# EasyEDA Pro project FOC12.epro, board PCB1
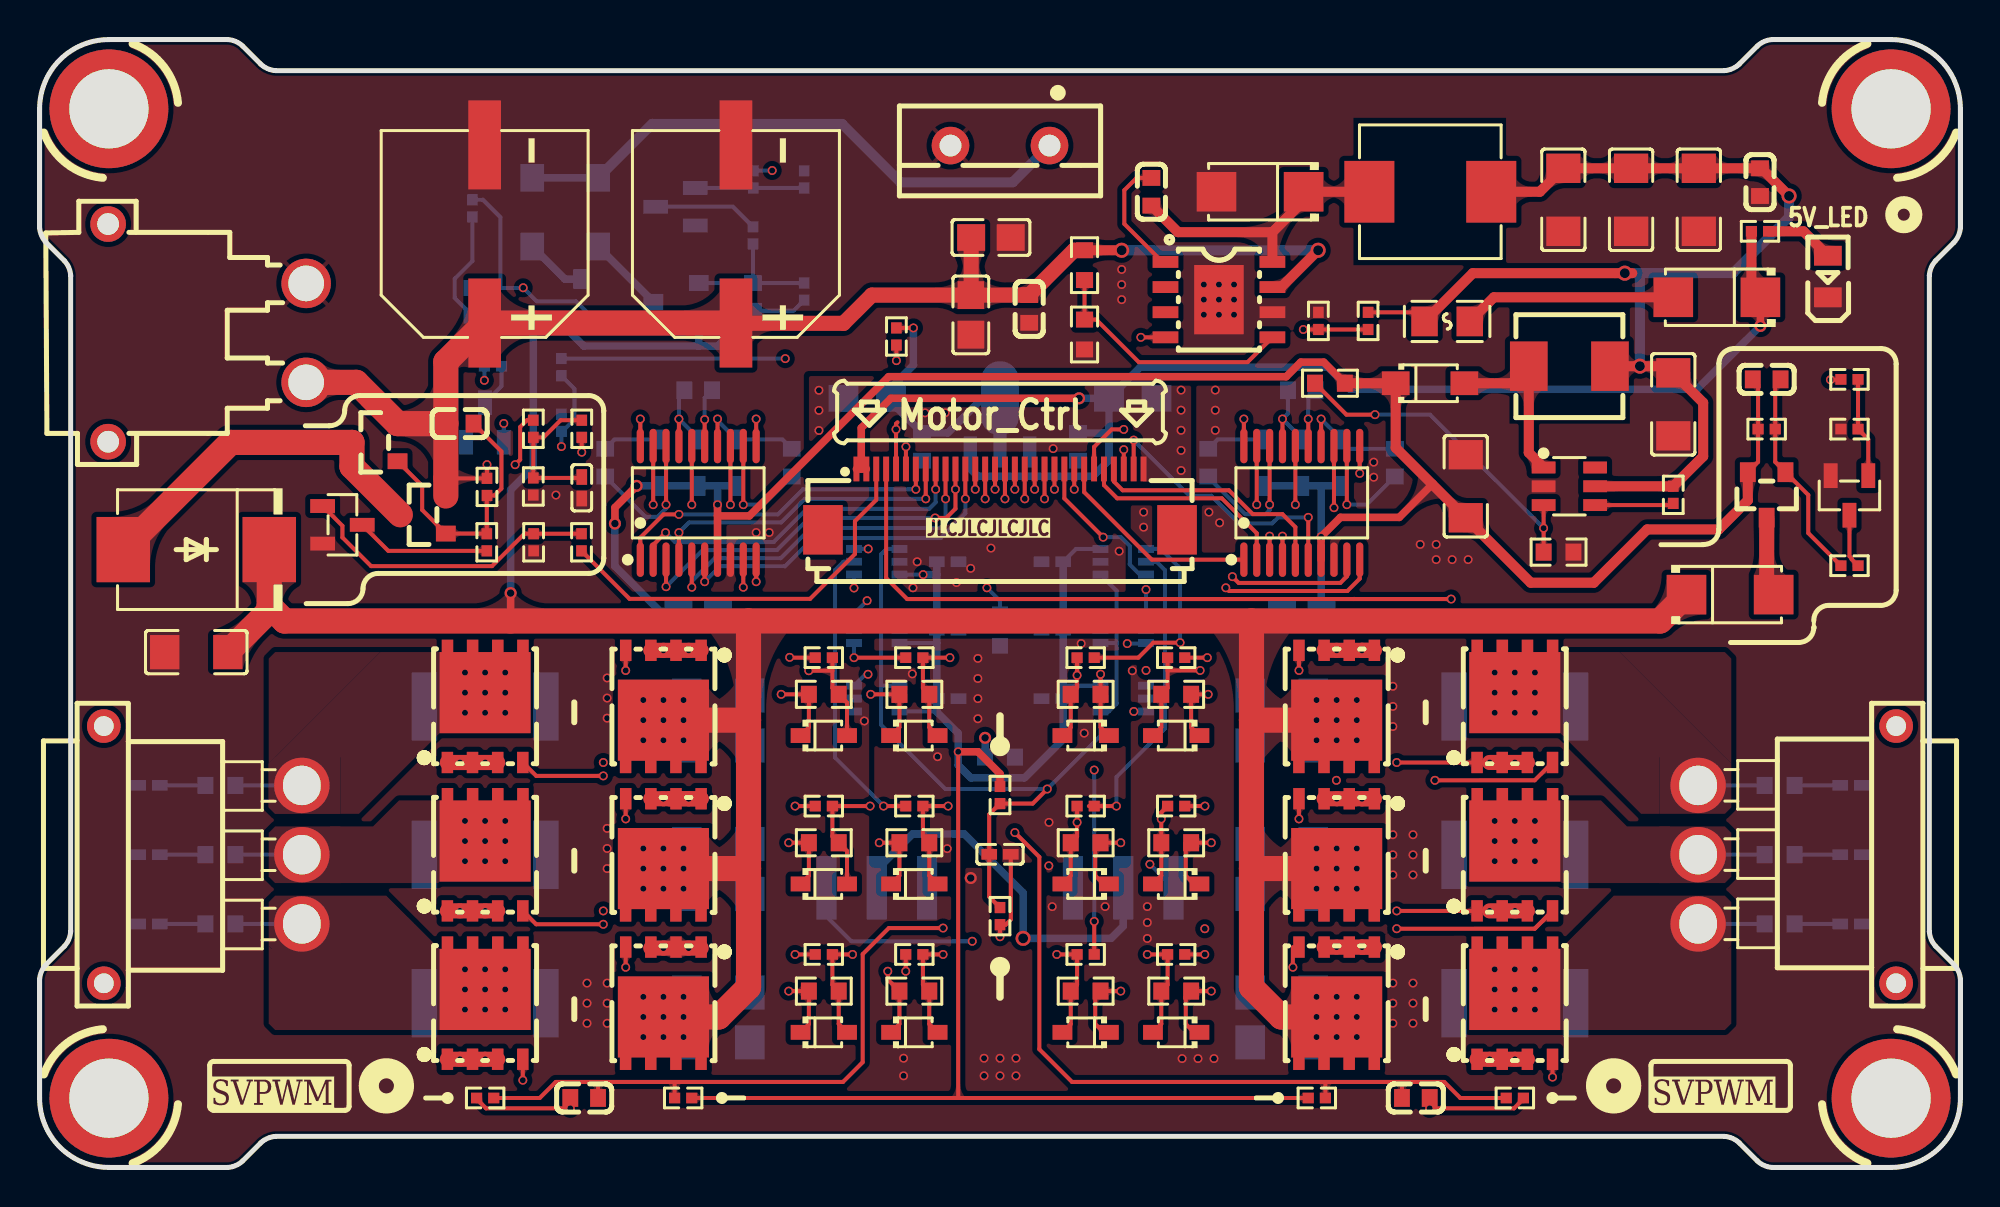
[diagram p8: board, top side]
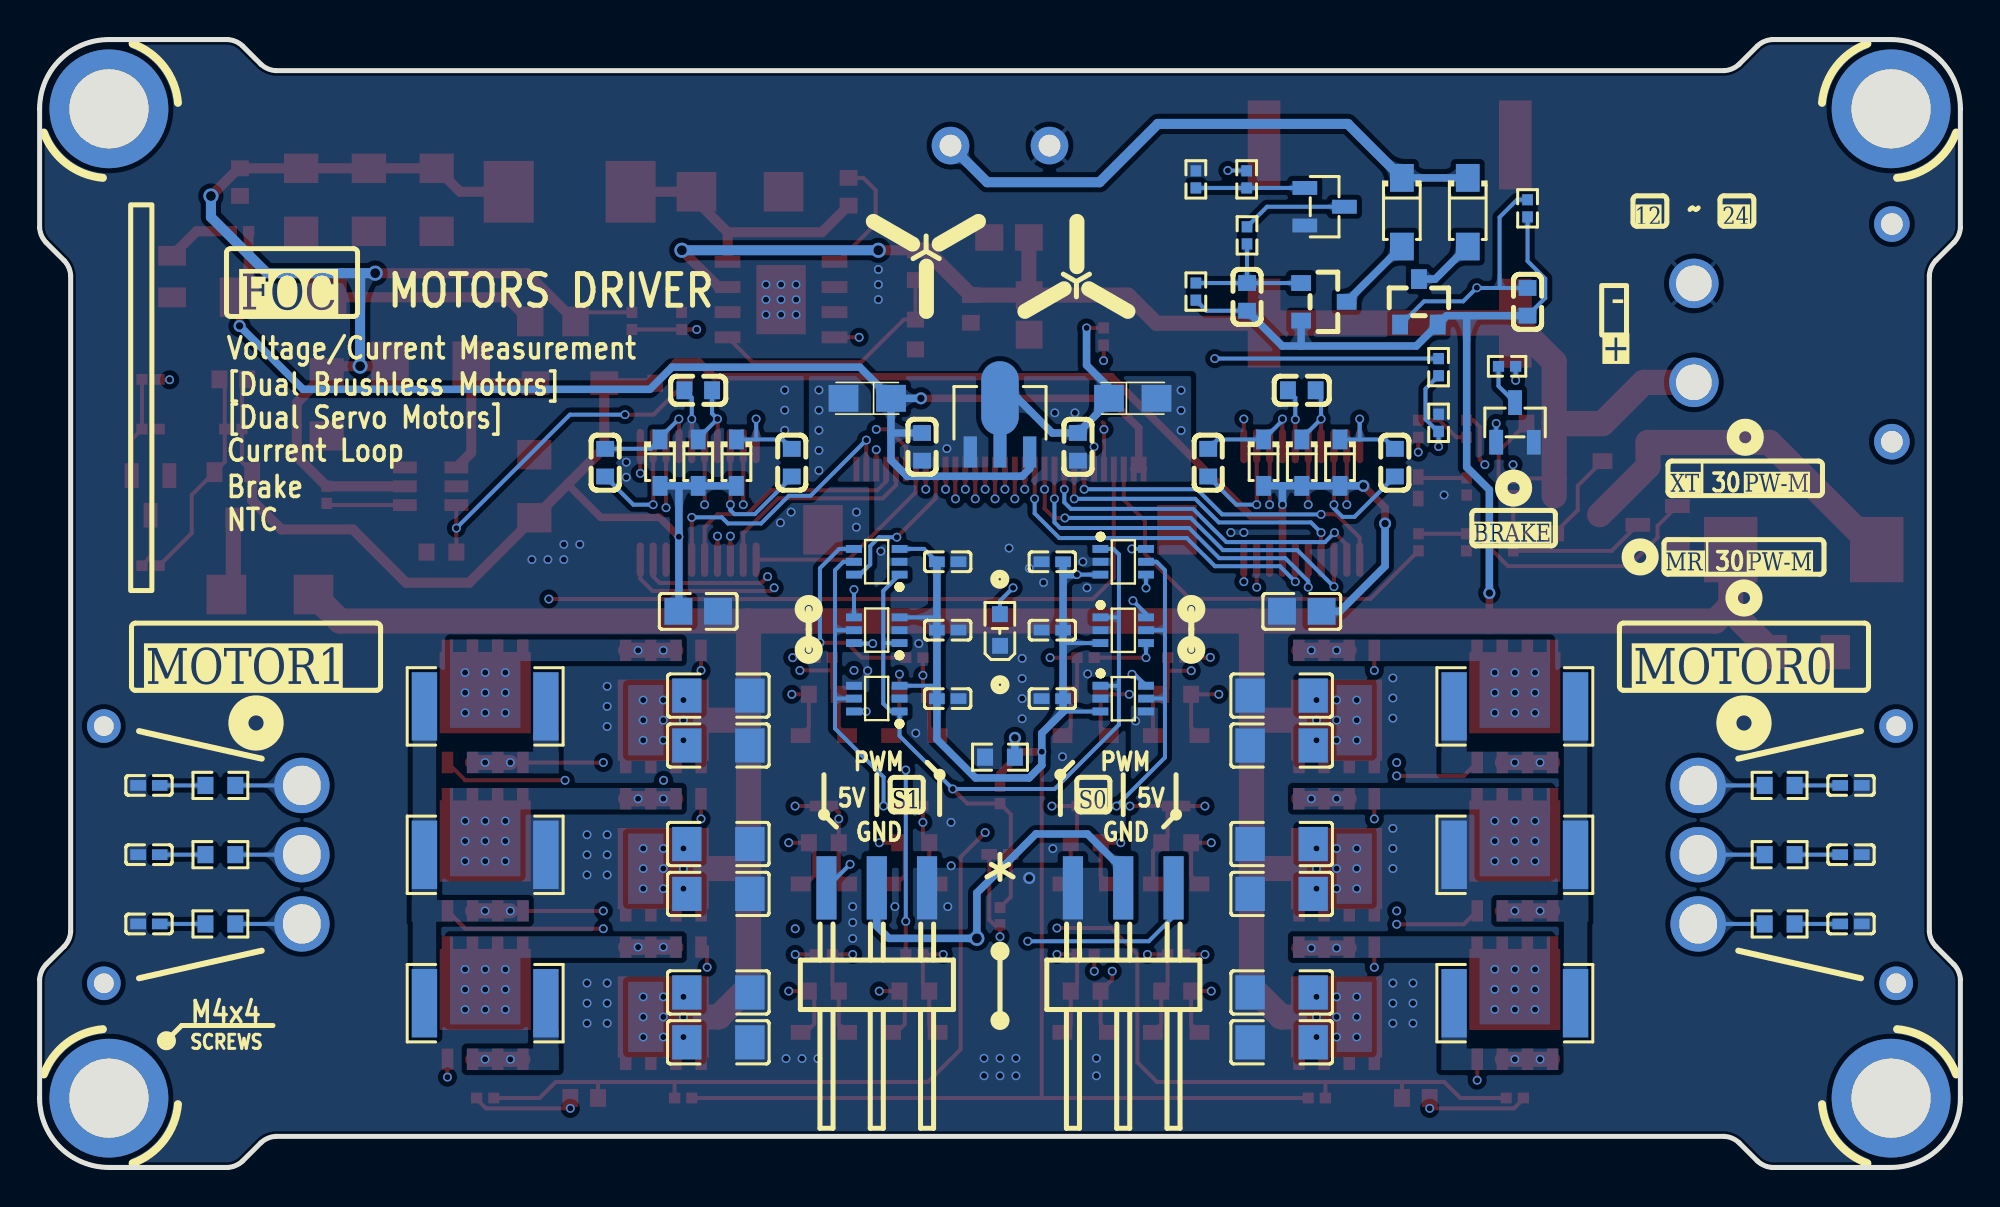
[diagram p9: board, bottom side, seen from below]

Outline 97 x 57 mm; copper layers: Top Layer, Inner1, Inner2, Bottom Layer. Coordinates in mm from the lower left corner of the outline.
Outline path: 0,53.5 0,47.5 arc(0.1,47.1) 0.33,46.75 1.24,45.83 arc(1.47,45.48) 1.57,45.08 1.57,11.92 arc(1.47,11.52) 1.24,11.17 0.33,10.25 arc(0.1,9.9) 0,9.5 0,3.5 arc(1.03,1.03) 3.5,0 9.5,0 arc(9.9,0.1) 10.25,0.32 11.17,1.24 arc(11.52,1.47) 11.92,1.57 85.08,1.57 arc(85.48,1.47) 85.83,1.24 86.75,0.32 arc(87.1,0.1) 87.5,0 93.5,0 arc(95.97,1.03) 97,3.5 97,9.5 arc(96.9,9.9) 96.68,10.25 95.76,11.17 arc(95.53,11.52) 95.43,11.92 95.43,45.08 arc(95.53,45.48) 95.76,45.83 96.68,46.75 arc(96.9,47.1) 97,47.5 97,53.5 arc(95.97,55.97) 93.5,57 87.5,57 arc(87.1,56.9) 86.75,56.67 85.83,55.76 arc(85.48,55.53) 85.08,55.43 11.92,55.43 arc(11.52,55.53) 11.17,55.76 10.25,56.67 arc(9.9,56.9) 9.5,57 3.5,57 arc(1.03,55.97) 0,53.5
Stack: Top Layer 0.035mm 外层铜厚1oz / Dielectric1 0.2104mm 7628 RC49% 8.6mil / Inner1 0.0152mm 内层铜厚 / Dielectric2 1.065mm 1.1mm H/HOZ Copper / Inner2 0.0152mm 内层铜厚 / Dielectric3 0.2104mm 7628 RC49% 8.6mil / Bottom Layer 0.035mm 外层铜厚1oz

## Design rules (mm)
template: 自定义配置
spacing copperThickness1oz (default): track to track 0.102, other pairs 0.152 to 0.3
spacing copperThickness2oz: track to track 0.203, other pairs 0.152 to 0.3
track width copperThickness1oz (default): min 0.127, default 0.254, max 2.54
track width copperThickness2oz: min 0.203, default 0.254, max 2.54
differential pair differentialPair (default): width min 0.127, default 0.254, max 2.54; gap min 0.152, default 0.152
via viaSize (default): diameter min 0.45, default 0.61, max 10; hole min 0.3, default 0.305, max 6.299

## Placement (name value [footprint] x y rotation side)
C1  100uF  [CAP-SMD_BD10.0-L10.3-W10.3-FD]  22.48 47.17 90 top
C2  100uF  [CAP-SMD_BD10.0-L10.3-W10.3-FD]  35.17 47.17 90 top
C3  10nF  [C0603]  56.15 49.31 270 top
C4  100nF  [C0603]  21.21 37.59 180 top
C5  47uF  [C1206]  82.5 38.56 90 top
C6  47uF  [C1206]  76.95 48.9 90 top
C7  47uF  [C1206]  80.37 48.9 90 top
C8  47uF  [C1206]  83.79 48.9 90 top
C9  100nF  [C0603]  86.88 49.79 270 top
C10  4.7uF  [C0805]  47.03 43.09 90 top
C11  4.7uF  [C0805]  48.04 47 180 top
C12  100nF  [C0603]  49.97 43.39 90 top
C13  47uF  [C1206]  72.02 34.42 270 top
C14  100nF  [C0603]  87.22 39.83 180 top
C15  2.2nF  [C0402]  27.38 34.35 90 top
C16  47uF  [C1206]  7.91 26.04 0 top
C17  22uF  [C1206]  34.28 8.84 180 bottom
C18  22uF  [C1206]  34.28 6.32 180 bottom
C19  22uF  [C1206]  34.28 16.34 180 bottom
C20  22uF  [C1206]  34.28 13.82 180 bottom
C21  22uF  [C1206]  34.28 21.32 180 bottom
C22  22uF  [C1206]  34.28 23.85 180 bottom
C23  100nF  [C0603]  37.98 35.62 270 bottom
C24  1nF  [C0402]  5.52 12.31 180 bottom
C25  1nF  [C0402]  5.52 15.81 180 bottom
C26  1nF  [C0402]  5.52 19.31 180 bottom
C27  100nF  [C0603]  33.26 39.28 0 bottom
C28  100nF  [C0603]  28.56 35.62 270 bottom
C31  10uF  [C0805]  33.26 28.1 180 bottom
C32  22uF  [C1206]  62.72 21.32 0 bottom
C33  22uF  [C1206]  62.72 23.85 0 bottom
C34  22uF  [C1206]  62.72 16.34 0 bottom
C35  22uF  [C1206]  62.72 13.82 0 bottom
C36  22uF  [C1206]  62.72 8.84 0 bottom
C37  22uF  [C1206]  62.72 6.32 0 bottom
C38  100nF  [C0603]  68.44 35.62 270 bottom
C39  1nF  [C0402]  91.48 19.31 0 bottom
C40  1nF  [C0402]  91.48 15.81 0 bottom
C41  1nF  [C0402]  91.48 12.31 0 bottom
C42  100nF  [C0603]  63.74 39.28 0 bottom
C43  100nF  [C0603]  59.02 35.62 270 bottom
C46  10uF  [C0805]  63.74 28.1 0 bottom
C47  100nF  [C0402]  45.86 23.69 180 bottom
C48  100nF  [C0402]  45.86 27.15 180 bottom
C49  100nF  [C0402]  45.86 30.61 180 bottom
C50  100nF  [C0603]  27.5 3.51 0 top
C51  100nF  [C0603]  69.5 3.51 180 top
C52  100nF  [C0402]  48.5 15.82 180 top
C53  100nF  [C0402]  51.14 23.69 0 bottom
C54  100nF  [C0402]  51.14 27.15 0 bottom
C55  100nF  [C0402]  51.14 30.61 0 bottom
C56  22uF  [CASE-A_3216]  55.21 38.87 0 bottom
C57  100nF  [C0603]  52.44 36.42 90 bottom
C58  22uF  [CASE-A_3216]  41.79 38.87 180 bottom
C59  100nF  [C0603]  44.56 36.42 90 bottom
C60  100nF  [C0603]  36.03 44 270 bottom
C61  100nF  [C0603]  21.86 43.75 270 bottom
CN1  XT30PW-M  [CONN-TH_XT30PW-M]  8.46 42.18 270 top
D1  SS34  [SMA_L4.3-W2.6-LS5.2-RD]  84.7 43.97 180 top
D2  DSK34  [SOD-123FL_L2.7-W1.8-LS3.8-RD]  70.22 39.63 0 top
D3  SS34  [SMA_L4.3-W2.6-LS5.2-RD]  85.37 28.95 0 top
D4  SS34  [SMA_L4.3-W2.6-LS5.2-RD]  61.63 49.31 180 top
D5  SK104C  [SMC_L6.9-W5.9-LS7.9-RD]  7.91 31.22 180 top
D6  1N5819WS  [SOD-323_L1.8-W1.3-LS2.5-RD]  35.19 35.62 270 bottom
D7  1N5819WS  [SOD-323_L1.8-W1.3-LS2.5-RD]  33.26 35.62 270 bottom
D8  1N5819WS  [SOD-323_L1.8-W1.3-LS2.5-RD]  31.33 35.62 270 bottom
D9  1N5819WS  [SOD-323_L1.8-W1.3-LS2.5-RD]  39.6 6.83 0 top
D10  1N5819WS  [SOD-323_L1.8-W1.3-LS2.5-RD]  39.6 14.33 0 top
D11  1N5819WS  [SOD-323_L1.8-W1.3-LS2.5-RD]  39.6 21.83 0 top
D12  1N5819WS  [SOD-323_L1.8-W1.3-LS2.5-RD]  44.17 6.83 0 top
D13  1N5819WS  [SOD-323_L1.8-W1.3-LS2.5-RD]  44.17 14.33 0 top
D14  1N5819WS  [SOD-323_L1.8-W1.3-LS2.5-RD]  44.17 21.83 0 top
D15  1N5819WS  [SOD-323_L1.8-W1.3-LS2.5-RD]  65.67 35.62 270 bottom
D16  1N5819WS  [SOD-323_L1.8-W1.3-LS2.5-RD]  63.74 35.62 270 bottom
D17  1N5819WS  [SOD-323_L1.8-W1.3-LS2.5-RD]  61.81 35.62 270 bottom
D18  1N5819WS  [SOD-323_L1.8-W1.3-LS2.5-RD]  57.4 21.83 180 top
D19  1N5819WS  [SOD-323_L1.8-W1.3-LS2.5-RD]  57.4 14.33 180 top
D20  1N5819WS  [SOD-323_L1.8-W1.3-LS2.5-RD]  57.4 6.83 180 top
D21  1N5819WS  [SOD-323_L1.8-W1.3-LS2.5-RD]  52.83 21.83 180 top
D22  1N5819WS  [SOD-323_L1.8-W1.3-LS2.5-RD]  52.83 14.33 180 top
D23  1N5819WS  [SOD-323_L1.8-W1.3-LS2.5-RD]  52.83 6.83 180 top
D24  DSK34  [SOD-123FL_L2.7-W1.8-LS3.8-RD]  28.21 48.28 270 bottom
D25  DSK34  [SOD-123FL_L2.7-W1.8-LS3.8-RD]  24.88 48.28 270 bottom
F1  SMD0805-100  [F0805]  71.08 42.76 0 top
FPC1  FPC-05F-30PH20  [FPC-SMD_30P-P0.50_XUNPU_FPC-05F-30PH20]  48.5 33.76 0 top
L1  22uH  [IND-SMD_L7.3-W6.6_MHCI06030]  70.23 49.31 0 top
L2  10uH  [IND-SMD_L5.4-W5.2_FXL0530]  77.25 40.49 180 top
LED1  KT-0805Y_黄  [LED0805-R-RD]  90.31 45.02 90 top
LED2  NCD0603G1_绿  [LED0603-RD_1]  48.5 27.16 90 bottom
NOREF  -  [Pad_e19069]  3.5 53.5 180 top
NOREF#2  -  [Pad_e19066]  93.5 3.5 180 top
NOREF#3  -  [Pad_e19067]  3.5 3.5 180 top
NOREF#4  -  [Pad_e19068]  93.5 53.5 180 top
Q1  WST4041  [SOT-23_L2.9-W1.3-P1.90-LS2.4-BR]  87.22 33.99 90 top
Q2  WST4041  [SOT-23_L2.9-W1.3-P1.90-LS2.4-BR]  16.92 36.64 0 top
Q3  WST4041  [SOT-23_L2.9-W1.3-P1.90-LS2.4-BR]  19.36 32.98 0 top
Q4  S8050  [SOT-23-3_L2.9-W1.3-P1.90-LS2.4-BR]  91.4 33.96 90 top
Q5  S8050  [SOT-23-3_L2.9-W1.3-P1.90-LS2.4-BR]  15.29 32.48 180 top
Q6  KNY3406C  [PDFN-8_L4.9-W5.8-P1.27-LS6.1-BL]  31.5 8.3 180 top
Q7  KNY3406C  [PDFN-8_L4.9-W5.8-P1.27-LS6.1-BL]  31.5 15.8 180 top
Q8  KNY3406C  [PDFN-8_L4.9-W5.8-P1.27-LS6.1-BL]  31.5 23.3 180 top
Q9  KNY3406C  [PDFN-8_L4.9-W5.8-P1.27-LS6.1-BL]  22.5 8.3 0 top
Q10  KNY3406C  [PDFN-8_L4.9-W5.8-P1.27-LS6.1-BL]  22.5 15.8 0 top
Q11  KNY3406C  [PDFN-8_L4.9-W5.8-P1.27-LS6.1-BL]  22.5 23.3 0 top
Q12  KNY3406C  [PDFN-8_L4.9-W5.8-P1.27-LS6.1-BL]  65.5 23.3 180 top
Q13  KNY3406C  [PDFN-8_L4.9-W5.8-P1.27-LS6.1-BL]  65.5 15.8 180 top
Q14  KNY3406C  [PDFN-8_L4.9-W5.8-P1.27-LS6.1-BL]  65.5 8.3 180 top
Q15  KNY3406C  [PDFN-8_L4.9-W5.8-P1.27-LS6.1-BL]  74.5 23.3 0 top
Q16  KNY3406C  [PDFN-8_L4.9-W5.8-P1.27-LS6.1-BL]  74.5 15.8 0 top
Q17  KNY3406C  [PDFN-8_L4.9-W5.8-P1.27-LS6.1-BL]  74.5 8.3 0 top
Q18  AMS1117-3.3V  [SOT-89-3_L4.5-W2.5-P1.50-LS4.2-BR]  48.5 37.51 270 bottom
Q19  WST4041  [SOT-23_L2.9-W1.3-P1.90-LS2.4-BR]  32.14 43.75 0 bottom
Q20  WST4041  [SOT-23_L2.9-W1.3-P1.90-LS2.4-BR]  27.34 43.75 270 bottom
Q21  S8050  [SOT-23-3_L2.9-W1.3-P1.90-LS2.4-BR]  32.11 48.55 0 bottom
Q22  S8050  [SOT-23-3_L2.9-W1.3-P1.90-LS2.4-BR]  22.49 37.65 270 bottom
R1  10kΩ  [R0402]  22.59 34.39 90 top
R2  330kΩ  [R0603]  52.77 45.6 90 top
R3  11.5kΩ  [R0402]  67.09 42.78 90 top
R4  0603WAF6802T5E  [R0603]  65.16 39.63 0 top
R5  100kΩ  [R0402]  24.93 37.33 90 top
R6  10kΩ  [R0402]  87.22 37.31 180 top
R7  10kΩ  [R0402]  91.4 30.41 180 top
R8  10kΩ  [R0402]  22.58 31.59 90 top
R9  0603WAF6802T5E  [R0603]  52.77 42.09 90 top
R10  3.3kΩ  [R0402]  64.58 42.78 270 top
R11  10kΩ  [R0402]  82.5 33.99 90 top
R12  3.4kΩ  [R0603]  76.71 31.1 180 top
R13  1kΩ  [R0402]  27.38 37.33 90 top
R14  10kΩ  [R0402]  24.93 34.41 270 top
R15  0Ω  [R0603]  48.5 20.73 180 bottom
R16  10kΩ  [R0402]  91.4 39.83 180 top
R17  10kΩ  [R0402]  27.37 31.59 270 top
R18  10kΩ  [R0402]  91.4 37.31 180 top
R19  10kΩ  [R0402]  24.95 31.59 270 top
R20  0603WAF100JT5E  [R0603]  39.6 8.91 0 top
R21  0603WAF100JT5E  [R0603]  39.6 16.41 0 top
R22  0603WAF100JT5E  [R0603]  39.6 23.91 0 top
R23  20kΩ  [R0402]  39.6 10.76 0 top
R24  0603WAF100JT5E  [R0603]  9.13 12.31 0 bottom
R25  20kΩ  [R0402]  39.6 18.26 0 top
R26  0603WAF100JT5E  [R0603]  9.13 15.81 0 bottom
R27  20kΩ  [R0402]  39.6 25.76 0 top
R28  0603WAF100JT5E  [R0603]  9.13 19.31 0 bottom
R30  0603WAF100JT5E  [R0603]  44.17 8.91 0 top
R31  0603WAF100JT5E  [R0603]  44.17 16.41 0 top
R33  0603WAF100JT5E  [R0603]  44.17 23.91 0 top
R34  10mΩ  [R2512]  22.5 8.3 0 bottom
R35  20kΩ  [R0402]  44.17 10.76 0 top
R36  20kΩ  [R0402]  44.17 18.26 0 top
R37  10mΩ  [R2512]  22.5 23.3 0 bottom
R38  20kΩ  [R0402]  44.17 25.76 0 top
R41  10mΩ  [R2512]  22.5 15.8 180 bottom
R42  0603WAF100JT5E  [R0603]  57.4 23.91 180 top
R43  0603WAF100JT5E  [R0603]  57.4 16.41 180 top
R44  0603WAF100JT5E  [R0603]  57.4 8.91 180 top
R45  20kΩ  [R0402]  57.4 25.76 180 top
R46  0603WAF100JT5E  [R0603]  87.87 19.31 180 bottom
R47  20kΩ  [R0402]  57.4 18.26 180 top
R48  0603WAF100JT5E  [R0603]  87.87 15.81 180 bottom
R49  20kΩ  [R0402]  57.4 10.76 180 top
R50  0603WAF100JT5E  [R0603]  87.87 12.31 180 bottom
R52  0603WAF100JT5E  [R0603]  52.83 23.91 180 top
R53  0603WAF100JT5E  [R0603]  52.83 16.41 180 top
R55  0603WAF100JT5E  [R0603]  52.83 8.91 180 top
R56  10mΩ  [R2512]  74.5 23.3 180 bottom
R57  20kΩ  [R0402]  52.83 25.76 180 top
R58  20kΩ  [R0402]  52.83 18.26 180 top
R59  10mΩ  [R2512]  74.5 8.3 180 bottom
R60  20kΩ  [R0402]  52.83 10.76 180 top
R63  10mΩ  [R2512]  74.5 15.8 0 bottom
R64  NCP15XH103F03RC  [R0402]  32.5 3.51 0 top
R65  NCP15XH103F03RC  [R0402]  64.5 3.51 180 top
R66  10kΩ  [R0402]  48.5 18.82 270 top
R67  10kΩ  [R0402]  48.5 12.7 270 top
R68  3kΩ  [R0402]  22.5 3.51 0 top
R69  3kΩ  [R0402]  74.5 3.51 180 top
R70  4.7kΩ  [R0402]  86.88 47.31 180 top
R71  3kΩ  [R0402]  43.27 41.99 90 top
R72  10kΩ  [R0402]  38.61 44.26 270 bottom
R73  10kΩ  [R0402]  21.86 48.47 270 bottom
R74  10kΩ  [R0402]  36.03 47.1 270 bottom
R75  10kΩ  [R0402]  22.89 40.49 180 bottom
R76  10kΩ  [R0402]  36.04 49.93 90 bottom
R77  10kΩ  [R0402]  38.61 49.93 90 bottom
R78  10kΩ  [R0402]  26.35 40.44 90 bottom
R79  10kΩ  [R0402]  26.35 37.63 90 bottom
U1  TPS5430DDAR  [ESOP-8_L4.9-W3.9-P1.27-LS6.0-TL-EP]  59.56 43.86 0 top
U2  MT3608L  [SOT-23-6_L2.9-W1.6-P0.95-LS2.8-BL_3]  77.25 34.42 270 top
U3  FD6288T  [TSSOP-20_L6.5-W4.4-P0.65-LS6.4-BL]  33.26 33.59 0 top
U4  FD6288T  [TSSOP-20_L6.5-W4.4-P0.65-LS6.4-BL]  63.74 33.59 0 top
U5  TP181A1-CR  [SC70-6_L2.1-W1.3-P0.65-LS2.3-BL]  42.28 30.61 270 bottom
U6  TP181A1-CR  [SC70-6_L2.1-W1.3-P0.65-LS2.3-BL]  54.72 30.61 90 bottom
U7  TP181A1-CR  [SC70-6_L2.1-W1.3-P0.65-LS2.3-BL]  42.28 23.69 270 bottom
U8  TP181A1-CR  [SC70-6_L2.1-W1.3-P0.65-LS2.3-BL]  42.28 27.15 270 bottom
U9  TP181A1-CR  [SC70-6_L2.1-W1.3-P0.65-LS2.3-BL]  54.72 27.15 90 bottom
U10  TP181A1-CR  [SC70-6_L2.1-W1.3-P0.65-LS2.3-BL]  54.72 23.69 90 bottom
U11  KH-2.54PH-1X3P-L13.5-WT  [HDR-SMD_3P-P2.54-H-M_KH-2.54PH-1X3P-L13.5-WT]  42.28 14.13 180 bottom
U12  KH-2.54PH-1X3P-L13.5-WT  [HDR-SMD_3P-P2.54-H-M_KH-2.54PH-1X3P-L13.5-WT]  54.72 14.13 180 bottom
U13  MR30PW-M30.G.Y  [CONN-TH_MR30PW-M30-G-Y]  8.24 15.81 270 top
U14  MR30PW-M30.G.Y  [CONN-TH_MR30PW-M30-G-Y]  88.76 15.81 90 top
U15  10Ω  [TO-220-2_L10.1-W4.5-P5.08-L]  48.5 51.64 180 top

## Footprints (pads in the part's own frame, mm; a bottom-side part is the same pattern mirrored in y, then rotated)
C0402
  rect 0.79x0.54 smd: 1(-0.545,0) 2(0.545,0)
C0603
  rect 0.8x0.9 smd: 1(-0.7,0) 2(0.7,0)
C0805
  rect 1.41x1.35 smd: 1(-1,0) 2(1,0)
C1206
  rect 1.485x1.728 smd: 1(-1.593,0) 2(1.593,0)
CAP-SMD_BD10.0-L10.3-W10.3-FD
  rect 4.5x1.65 smd: 1(-4.5,0) 2(4.5,0)
CASE-A_3216
  rect 1.5x1.359 smd: 1(-1.2,0) 2(1.2,0)
CONN-TH_MR30PW-M30-G-Y
  round 2.8 hole 1.995x1.9: 1(-3.5,5) 2(0,5) 3(3.5,5)
  round 1.7 hole 1: 4(6.5,-5) 5(-6.5,-5)
CONN-TH_XT30PW-M
  round 2.5 hole 1.8: 1(-2.5,5) 2(2.5,5)
  round 1.8 hole 1.1: 3(5.5,-5) 4(-5.5,-5)
ESOP-8_L4.9-W3.9-P1.27-LS6.0-TL-EP
  rect 1.3x0.6 smd: 1(-2.7,1.905) 2(-2.7,0.635) 3(-2.7,-0.635) 4(-2.7,-1.905) 5(2.7,-1.905) 6(2.7,-0.635) 7(2.7,0.635) 8(2.7,1.905)
  rect 2.5x3.5 smd: 9(0,0)
F0805
  rect 1.335x1.5 smd: 1(-1.143,0) 2(1.143,0)
FPC-SMD_30P-P0.50_XUNPU_FPC-05F-30PH20
  rect 0.3x1.25 smd: 1(-7.25,1.538) 2(-6.75,1.538) 3(-6.25,1.538) 4(-5.75,1.538) 5(-5.25,1.538) 6(-4.75,1.538) 7(-4.25,1.538) 8(-3.75,1.538) 9(-3.25,1.538) 10(-2.75,1.538) 11(-2.25,1.538) 12(-1.75,1.538) 13(-1.25,1.538) 14(-0.75,1.538) 15(-0.25,1.538) 16(0.25,1.538) 17(0.75,1.538) 18(1.25,1.538) 19(1.75,1.538) 20(2.25,1.538) 21(2.75,1.538) 22(3.25,1.538) 23(3.75,1.538) 24(4.25,1.538) 25(4.75,1.538) 26(5.25,1.538) 27(5.75,1.538) 28(6.25,1.538) 29(6.75,1.538) 30(7.25,1.538)
  rect 2x2.5 smd: 31(8.94,-1.538) 32(-8.94,-1.538)
HDR-SMD_3P-P2.54-H-M_KH-2.54PH-1X3P-L13.5-WT
  rect 1.02x3.2 smd: 1(-2.54,0) 2(0,0) 3(2.54,0)
IND-SMD_L5.4-W5.2_FXL0530
  rect 1.9x2.5 smd: 1(-2.05,0) 2(2.05,0)
IND-SMD_L7.3-W6.6_MHCI06030
  rect 2.525x3.119 smd: 1(-3.079,0) 2(3.079,0)
LED0603-RD_1
  rect 0.8x0.8 smd: 1(-0.799,-0.004) 2(0.799,0.004)
LED0805-R-RD
  rect 1x1.399 smd: 1(1.05,0) 2(-1.05,0)
Pad_e19066
  round 6 hole 4: 1(0,0)
Pad_e19067
  round 6 hole 4: 1(0,0)
Pad_e19068
  round 6 hole 4: 1(0,0)
Pad_e19069
  round 6 hole 4: 1(0,0)
PDFN-8_L4.9-W5.8-P1.27-LS6.1-BL
  rect 0.58x1.079 smd: 1(-1.907,-2.834) 2(-0.637,-2.834) 3(0.632,-2.834) 4(1.903,-2.834)
  rect 0.58x1.08 smd: 5(1.907,2.834) 6(0.637,2.834) 7(-0.632,2.834) 8(-1.903,2.834)
  rect 4.6x4.1 smd: 9(-0.003,0.695)
R0402
  rect 0.566x0.54 smd: 1(-0.433,0) 2(0.433,0)
R0603
  rect 0.806x0.864 smd: 1(-0.753,0) 2(0.753,0)
R2512
  rect 1.282x3.456 smd: 1(-3.067,0) 2(3.067,0)
SC70-6_L2.1-W1.3-P0.65-LS2.3-BL
  rect 0.399x0.8 smd: 1(-0.65,-1.151) 2(0,-1.151) 3(0.65,-1.151) 4(0.65,1.151) 5(0,1.151) 6(-0.65,1.151)
SMA_L4.3-W2.6-LS5.2-RD
  rect 2x2 smd: 1(-2.2,0) 2(2.2,0)
SMC_L6.9-W5.9-LS7.9-RD
  rect 2.7x3.3 smd: 1(-3.687,0) 2(3.687,0)
SOD-123FL_L2.7-W1.8-LS3.8-RD
  rect 1.4x1.2 smd: 1(-1.735,0) 2(1.735,0)
SOD-323_L1.8-W1.3-LS2.5-RD
  rect 1x0.75 smd: 1(-1.173,0) 2(1.173,0)
SOT-23-3_L2.9-W1.3-P1.90-LS2.4-BR
  rect 1.25x0.7 smd: 1(1,-0.95) 2(1,0.95) 3(-1,0)
SOT-23-6_L2.9-W1.6-P0.95-LS2.8-BL_3
  rect 0.6x1.2 smd: 1(-0.95,-1.3) 2(0,-1.3) 3(0.95,-1.3) 4(0.95,1.3) 5(0,1.3) 6(-0.95,1.3)
SOT-23_L2.9-W1.3-P1.90-LS2.4-BR
  rect 1x0.8 smd: 1(1.15,-0.95) 2(1.15,0.95) 3(-1.15,0)
SOT-89-3_L4.5-W2.5-P1.50-LS4.2-BR
  rect 1.575x0.672 smd: 1(1.356,-1.5) 3(1.356,1.5)
  custom 5.377x1.9 smd: 2(-1.356,0)
TO-220-2_L10.1-W4.5-P5.08-L
  round 1.9 hole 1.1: 1(-2.5,0) 2(2.5,0)
TSSOP-20_L6.5-W4.4-P0.65-LS6.4-BL
  oval 0.364x1.742 smd: 1(-2.925,-2.871) 2(-2.275,-2.871) 3(-1.625,-2.871) 4(-0.975,-2.871) 5(-0.325,-2.871) 6(0.325,-2.871) 7(0.975,-2.871) 8(1.625,-2.871) 9(2.275,-2.871) 10(2.925,-2.871) 11(2.925,2.871) 12(2.275,2.871) 13(1.625,2.871) 14(0.975,2.871) 15(0.325,2.871) 16(-0.325,2.871) 17(-0.975,2.871) 18(-1.625,2.871) 19(-2.275,2.871) 20(-2.925,2.871)

## Nets
As in the schematic.

Pads without a net: CN1 3 4; FPC1 31 32; NOREF 1; NOREF#2 1; NOREF#3 1; NOREF#4 1; U1 2 3; U2 6; U13 4 5; U14 4 5

## Via types
v1: diameter 0.45, hole 0.305, Top Layer to Bottom Layer, 383 vias
v2: diameter 0.61, hole 0.381, Top Layer to Bottom Layer, 7 vias
v3: diameter 0.762, hole 0.5, Top Layer to Bottom Layer, 6 vias

## Routing (per net, layer and track width the routed paths; a pad name or vN(x,y) marks a point on that pad's centre or on a via; arc(x,y) is an arc through that point)
+3.3V: length 115.8
  Top Layer w0.203: R71.2 v1(44.13,42.43) ; 46.39,3.51 v1(46.39,21.01) ; 46.39,3.51 R64.2 ; 46.39,3.51 R65.2
  Top Layer w0.381: R66.1 48.5,19.9 47.39,21.01 v1(46.39,21.01)
  Inner2 w0.381: v1(44.13,42.43) 44.13,40.14 42.59,38.61 42.59,31.23 43.87,29.96 v1(44.62,29.96)
  Bottom Layer w0.203: 51.69,24.34 U10.3 ; U8.3 45.31,26.5 ; 53.57,31.26 52.34,31.26 C55.2 ; U9.3 51.69,27.8 ; U5.3 v1(44.62,29.96) ; 45.3,29.96 45.31,29.97 ; U7.3 45.29,23.04
  Bottom Layer w0.381: Q18.2 47.61,38.87 45.86,37.12 C59.2 42.99,38.69 C58.1 42.99,39.41 44.13,40.54 v1(44.13,42.43) ; 45.31,30.61 45.31,23.02 46.39,21.94 v1(46.39,21.01) 46.39,20.32 47.03,19.68 49.73,19.68 51.69,21.64 C53.2 C54.2 C55.2 ; v1(44.62,29.96) 45.3,29.96
+5.8V: length 60.1
  Top Layer w0.203: F1.1 69.48,43.21 R3.2
  Top Layer w0.508: U2.5 82.5,34.42 ; v3(88.35,49.09) 86.95,50.49 C9.1 C8.2 C7.2 C6.2 75.76,49.31 L1.2 ; F1.1 72.38,45.19 80.43,45.19 ; L2.1 v3(80.81,40.49) 82.16,40.49 C5.2 84.01,38.65 84.01,35.93 R11.2
  Bottom Layer w0.508: v3(88.35,49.09) 88.35,48.03 85.51,45.19 80.81,45.19 ; 80.81,45.19 v3(80.81,40.49) ; 80.81,45.19 v3(80.05,45.19)
+5V: length 165.6
  Top Layer w0.381: 41.49,35.3 FPC1.2 ; 41.49,35.3 41.49,37.37 42.99,38.87 v2(52.49,38.87) ; 41.49,35.3 FPC1.1 ; D1.1 v2(86.9,42.53)
  Top Layer w0.508: 86.45,47.31 86.45,44.43 D1.1
  Inner1 w0.508: v3(49.67,11.58) 49.67,7.25 53.02,3.89 78.62,3.89 80.86,6.13 80.86,20.99 86.9,27.03 v2(86.9,42.53)
  Bottom Layer w0.381: U12.2 54.72,12.19 54.11,11.58 v3(49.67,11.58) 49.67,13.88 46.69,16.85 44.09,16.85 42.28,15.04 U11.2 ; C56.1 55.58,40.44 65.06,40.44 66.18,39.33 83.7,39.33 v2(86.9,42.53) ; C56.1 54.01,37.12 ; C56.1 v2(52.49,38.87) ; 54.01,37.12 54.01,35.75 53.19,34.93 47.38,34.93 47,35.31 Q18.3 ; 54.01,37.12 C57.2
+12V: length 105.5
  Top Layer w0.203: Q1.2 86.78,35.65 R6.2 86.78,39.56 C14.2
  Top Layer w0.381: 34.24,32.93 35.84,32.93 42.88,39.96 62.95,39.96 63.69,40.7 64.85,40.7 R4.2 ; 34.24,32.93 34.24,30.72 ; 34.24,32.93 v1(34.24,33.49) ; 64.72,30.72 v1(64.72,31.87) 65.69,32.85 68.66,32.85 70.33,34.52 ; v2(29.05,32.54) 29.05,33.35 v2(30.15,34.45)
  Top Layer w0.508: 68.48,39.55 68.48,36.37 70.33,34.52 C13.2 75.3,29.55 78.49,29.55 81.18,32.24 84.8,32.24 86.27,33.71 Q1.2 ; R4.2 D2.1
  Top Layer w0.762: 68.48,39.55 D2.1
  Bottom Layer w0.381: 34.24,34.45 D7.2 D8.2 v2(30.15,34.45) ; 34.24,34.45 v1(34.24,33.49) ; 34.24,34.45 D6.2 ; C31.2 31.34,28.1 29.05,30.38 v2(29.05,32.54) ; C46.2 64.72,28.12 v1(64.72,31.87) 64.72,34.4 64.76,34.45 ; 64.76,34.45 D15.2 ; 64.76,34.45 D16.2 D17.2
DGND: length 66.1
  Top Layer w0.203: 22.07,3.51 22.07,3.46 22.55,2.99 v1(26.8,2.99) C50.1 ; v1(48.5,11.66) R67.2 48.79,12.27 49.05,12.52 C52.1 ; v1(70.2,2.99) 74.45,2.99 74.93,3.46 R69.1 ; 70.2,3.51 70.2,2.99
  Inner2 w0.203: v1(70.2,2.99) 57.17,2.99 v1(48.5,11.66) 39.83,2.99 v1(26.8,2.99)
  vias: v1(39.36,39.28) v1(39.36,38.26) v1(39.36,37.24) v1(44.07,24.94) v1(44.11,29.29) v1(44.32,30.61) v1(44.72,38.14) v1(45.35,20.76) v1(45.73,38.14) v1(45.83,16.11) v1(46.3,29.56) v1(47.02,30.28) v1(47.38,25.72) v1(47.38,24.71) v1(47.38,23.69) v1(47.38,22.68) v1(48.04,31.3) v1(50.97,17.44) v1(51.18,36.33) v1(52.6,26.48) v1(52.75,21.95) v1(54.52,31.14) v1(57.64,39.29) v1(57.64,38.27) v1(57.64,37.25) v1(57.64,36.24) v1(57.64,35.22)
PGND: length 8.4
  Inner2 w0.381: v2(47.02,14.62) 47.75,15.35 v2(47.75,21.71)
  Bottom Layer w0.381: R15.2 v2(47.75,21.71)
  vias: v1(26.08,33.98) v1(27.64,9.32) v1(27.64,8.3) v1(27.64,7.28) v1(28.66,24.74) v1(28.66,23.72) v1(28.66,22.71) v1(28.66,17.14) v1(28.66,16.12) v1(28.66,15.1) v1(28.66,9.32) v1(28.66,8.3) v1(28.66,7.28) v1(36.19,32.09) v1(36.84,32.09) v1(41.65,22.56) v1(43.63,5.52) v1(43.63,4.63) v1(47.7,5.52) v1(47.7,4.63) v1(48.5,5.52) v1(48.5,4.63) v1(49.31,5.52) v1(49.31,4.63) v1(50.97,15.24) v1(51.14,13.18) v1(53.81,13.18) v1(54.64,45.38) v1(54.64,44.62) v1(54.64,43.86) v1(55.18,25.1) v1(55.75,33.12) v1(55.75,32.36) v1(55.94,13.18) v1(55.94,12.38) v1(55.94,11.57) v1(57.7,5.5) v1(58.5,5.5) v1(58.79,44.62) v1(58.79,43.86) v1(58.79,43.1) v1(59.05,33.12) v1(59.37,39.29) v1(59.37,38.27) v1(59.37,37.25) v1(59.31,5.5) v1(59.56,44.62) v1(59.56,43.86) v1(59.56,43.1) v1(59.59,32.58) v1(60.32,44.62) v1(60.32,43.86) v1(60.32,43.1) v1(67.37,35.64) v1(67.37,34.88) v1(68.34,24.31) v1(68.34,23.3) v1(68.34,22.28) v1(68.34,16.81) v1(68.34,15.8) v1(68.34,14.78) v1(68.34,9.32) v1(68.34,8.3) v1(68.34,7.28) v1(69.36,16.81) v1(69.36,15.8) v1(69.36,14.78) v1(69.36,9.32) v1(69.36,8.3) v1(69.36,7.28) v1(69.72,31.49) v1(70.53,31.49) v1(70.53,30.72) v1(71.33,30.72) v1(72.14,30.72)
PVCC: length 74.1
  Top Layer w0.203: 24.93,37.76 24.61,37.76 24.27,37.42 24.27,35.77 v1(24.01,35.52) ; 20.51,34.82 22.59,34.82 R1.2 v1(22.59,35.52)
  Top Layer w0.508: U1.7 62.71,44.49 v3(64.57,46.35) ; R2.2 v3(54.64,46.35)
  Top Layer w0.762: 35.17,42.68 35.18,42.66 40.6,42.66 42.02,44.09 C10.2 ; R2.2 52.24,46.35 C12.2 ; C10.2 47.04,44.1 C11.2 ; C10.2 49.97,44.09
  Top Layer w1.27: 35.17,42.68 22.48,42.68 20.51,40.71 C4.2 ; CN1.2 15.99,39.68 Q2.2 C4.2 ; 20.51,33.93 C4.2
  Inner1 w0.203: v1(22.59,35.52) v1(24.01,35.52)
  Bottom Layer w0.508: v3(54.64,46.35) 64.49,46.35 64.57,46.28
VIN: length 175.9
  Top Layer w0.381: v2(23.79,29.03) 23.79,27.62
  Top Layer w1.27: 32.82,15.1 35.8,15.1 ; 35.8,15.1 35.8,9.11 34.3,7.61 32.82,7.61 ; 35.8,15.1 35.8,22.6 ; 61.2,27.62 81.83,27.62 D3.1 ; 61.2,27.62 61.2,22.6 ; 61.2,27.62 35.8,27.62 ; C16.2 11.6,28.14 11.6,28.39 ; 11.6,28.39 D5.1 ; 11.6,28.39 12.37,27.62 35.8,27.62 ; 32.82,22.6 35.8,22.6 ; 35.8,22.6 35.8,27.62 ; 64.18,22.6 61.2,22.6 ; 61.2,22.6 61.2,15.1 ; 61.2,15.1 61.2,9.11 62.7,7.61 64.18,7.61 ; 61.2,15.1 64.18,15.1
  Bottom Layer w0.203: R72.2 38.07,43.3 C60.2 ; C61.2 20.97,43.94 20.97,44.91 21.86,45.81 R73.2
  Bottom Layer w0.381: C61.2 24.93,43.05 ; 24.93,43.05 25.94,43.05 Q20.2 27.48,41.51 33.29,41.51 ; 24.93,43.05 24.93,35.39 23.79,34.25 v2(23.79,29.03) ; Q19.2 33.29,41.51 ; 33.29,41.51 34.24,41.51 C60.2
  vias: v1(30.49,23.62) v1(30.49,22.6) v1(30.49,21.59) v1(30.49,16.12) v1(30.49,15.1) v1(30.49,14.09) v1(30.49,8.62) v1(30.49,7.61) v1(30.49,6.59) v1(31.5,23.62) v1(31.5,22.6) v1(31.5,21.59) v1(31.5,16.12) v1(31.5,15.1) v1(31.5,14.09) v1(31.5,8.62) v1(31.5,7.61) v1(31.5,6.59) v1(32.52,23.62) v1(32.52,22.6) v1(32.52,21.59) v1(32.52,16.12) v1(32.52,15.1) v1(32.52,14.09) v1(32.52,8.62) v1(32.52,7.61) v1(32.52,6.59) v1(64.49,23.62) v1(64.49,22.6) v1(64.49,21.59) v1(64.49,16.12) v1(64.49,15.1) v1(64.49,14.09) v1(64.49,8.62) v1(64.49,7.61) v1(64.49,6.59) v1(65.5,23.62) v1(65.5,22.6) v1(65.5,21.59) v1(65.5,16.12) v1(65.5,15.1) v1(65.5,14.09) v1(65.5,8.62) v1(65.5,7.61) v1(65.5,6.59) v1(66.52,23.62) v1(66.52,22.6) v1(66.52,21.59) v1(66.52,16.12) v1(66.52,15.1) v1(66.52,14.09) v1(66.52,8.62) v1(66.52,7.61) v1(66.52,6.59)
M0_ADC: length 15.5
  Top Layer w0.203: FPC1.20 v1(50.75,33.79)
  Inner1 w0.203: v1(50.75,33.79) 50.75,32.95 42.72,24.92 v1(41.83,24.92)
  Bottom Layer w0.203: U7.6 41.7,24.92 v1(41.83,24.92)
M0_ADC_A: length 9.3
  Top Layer w0.203: FPC1.13 v1(47.25,34.27)
  Inner1 w0.203: v1(47.25,34.27) 47.23,34.25 47.23,32.78 46.51,32.06 42.65,32.06 v1(41.85,31.26)
  Bottom Layer w0.203: 41.13,31.26 v1(41.85,31.26)
M0_ADC_C: length 12.2
  Top Layer w0.203: FPC1.14 v1(47.75,33.79)
  Inner1 w0.203: v1(47.75,33.79) 47.75,32.44 46.71,31.4 43.45,31.4 41.79,29.74 v1(41.79,28.64)
  Bottom Layer w0.203: U8.6 41.13,27.98 v1(41.79,28.64)
M0_BK_OUT: length 19.4
  Top Layer w0.203: FPC1.5 v1(43.25,37.3) 43.25,37.58 43.32,37.66
  Inner1 w0.203: v1(36.99,50.38) 36.99,43.56 v1(43.25,37.3) 43.29,37.34 43.29,37.69
  Bottom Layer w0.203: 36.04,50.38 v1(36.99,50.38)
M0_HA: length 34.2
  Top Layer w0.203: v1(37.83,8.91) R20.1 38.85,7.25 D9.1 ; 30.99,36.46 v1(30.99,33.49)
  Inner2 w0.203: v1(30.99,33.49) 30.99,29.18 31.51,28.66 32.37,28.66 34.61,26.42 34.61,12.13 v1(37.83,8.91)
M0_HB: length 25.4
  Top Layer w0.203: v1(37.83,16.41) R21.1 38.85,14.74 D10.1 ; v1(32.94,33.49) 32.94,36.46
  Inner2 w0.203: v1(32.94,33.49) 32.94,31.7 34.3,30.33 34.3,27.77 35.75,26.32 35.75,18.49 v1(37.83,16.41)
M0_HC: length 17.3
  Top Layer w0.203: D11.1 38.85,22.24 R22.1 v1(37.45,23.91) ; 34.89,36.46 v1(34.89,33.49)
  Inner2 w0.203: v1(34.89,33.49) 34.89,27.97 36.31,26.55 36.31,25.05 v1(37.45,23.91)
M0_ISENSOR_NA: length 42
  Top Layer w0.203: R36.1 v1(42.62,18.26)
  Top Layer w0.762: Q10.3 Q10.2 Q10.1
  Inner1 w0.203: v1(28.47,12.96) 37.32,12.96 v1(42.62,18.26)
  Inner2 w0.203: v1(22.5,12.96) v1(28.47,12.96)
  Bottom Layer w0.203: U5.5 40.6,30.61 40.17,30.18 40.17,27.15 ; 40.17,23.69 40.17,27.15 ; 40.17,23.69 U7.5 ; 40.17,23.69 40.17,20.71 v1(42.62,18.26) ; 40.17,27.15 U8.5
  vias: v1(21.23,12.96)
M0_ISENSOR_PA: length 48.8
  Top Layer w0.203: R35.1 43.74,9.92
  Top Layer w0.762: Q9.1 v1(21.23,5.47) Q9.2 v1(22.5,5.47) Q9.3
  Inner1 w0.203: v1(43.74,9.92) 39.29,5.47 v1(22.5,5.47)
  Inner2 w0.203: v1(43.74,9.92) 44.65,10.83 44.65,26.59 41.96,29.28 v1(41.13,29.28)
  Bottom Layer w0.203: U5.4 v1(41.13,29.28)
M0_ISENSOR_PC: length 26.7
  Top Layer w0.203: R38.1 v1(41.13,25.76)
  Top Layer w0.762: Q11.3 v1(22.5,20.46) Q11.2 v1(21.23,20.46) Q11.1
  Inner1 w0.203: v1(28.47,20.46) 35.83,20.46 v1(41.13,25.76)
  Inner2 w0.203: v1(28.47,20.46) v1(22.5,20.46)
  Bottom Layer w0.203: U8.4 v1(41.13,25.76)
M0_LA: length 36
  Top Layer w0.203: v1(42.83,9.92) 42.83,9.5 R30.1 43.42,7.25 D12.1 ; 36.19,36.46 v1(36.19,37.82)
  Inner2 w0.203: v1(36.19,37.82) 37.57,36.44 37.57,31.74 43.45,25.86 43.45,16.5 42.83,15.88 v1(42.83,9.92)
M0_LB: length 22.5
  Top Layer w0.203: D13.1 43.42,14.74 R31.1 v1(42.4,16.41) ; 36.19,30.71 v1(36.19,29.6)
  Inner2 w0.203: v1(42.4,16.41) 42.4,16.52 43.1,17.21 43.1,25.65 39.15,29.6 v1(36.19,29.6)
M0_LC: length 13.8
  Top Layer w0.203: D14.1 43.42,22.24 R33.1 v1(41.97,23.91) ; U3.9 v1(35.54,29.32)
  Inner2 w0.203: v1(35.54,29.32) 40.95,23.91 v1(41.97,23.91)
M0_TIM1_CH1: length 19.6
  Top Layer w0.203: FPC1.11 v1(46.25,34.27) 46.25,33.29 45.78,32.82 v1(45.22,32.82) ; 31.64,30.72 v1(31.64,29.35)
  Bottom Layer w0.203: v1(31.64,29.35) 33.48,31.2 37.24,31.2 38.86,32.82 v1(45.22,32.82)
M0_TIM1_CH1N: length 18
  Top Layer w0.203: 33.59,30.72 33.59,29.6 ; FPC1.12 v1(46.75,33.79)
  Bottom Layer w0.203: v1(46.75,33.79) 46.75,33.06 45.5,31.81 39.07,31.81 37.64,30.38 34.37,30.38 v1(33.58,29.6)
M0_TIM1_CH2: length 18
  Top Layer w0.203: FPC1.9 v1(45.25,34.27) ; 30.99,30.72 30.99,31.46 v1(31.61,32.08)
  Bottom Layer w0.203: v1(45.25,34.27) 45.25,33.61 44.92,33.28 38.75,33.28 37.07,31.6 32.09,31.6 v1(31.61,32.08)
M0_TIM1_CH2N: length 18.4
  Top Layer w0.203: 32.94,30.72 v1(32.94,29.32) ; v1(45.75,33.79) FPC1.10
  Bottom Layer w0.203: v1(45.75,33.79) 45.75,32.6 45.47,32.32 38.95,32.32 37.42,30.79 34.1,30.79 32.94,29.63 v1(32.94,29.32)
M0_TIM1_CH3: length 17.1
  Top Layer w0.203: 30.34,30.72 30.34,31.83 31.51,33 v1(32.29,33) ; FPC1.7 v1(44.25,34.27)
  Bottom Layer w0.203: v1(32.29,33) 37.28,33 38.55,34.27 v1(44.25,34.27)
M0_TIM1_CH3N: length 16
  Top Layer w0.203: v1(44.75,33.79) FPC1.8 ; 32.29,30.72 v1(32.29,32.08)
  Bottom Layer w0.203: v1(32.29,32.08) 32.8,32.6 37.45,32.6 38.64,33.79 v1(44.75,33.79)
M0_U: length 46.9
  Top Layer w0.203: R23.1 v1(38.15,10.76) ; 31.64,36.43 v1(31.64,33.49)
  Top Layer w0.762: 33.41,11.08 v1(32.78,11.08) v1(31.5,11.09) 30.87,11.09
  Inner1 w0.203: v1(38.15,10.76) 37.78,11.13 33.08,11.13 ; v1(31.5,11.08) 28.69,11.08 27.32,12.45 27.32,28.79 31.64,33.1 v1(31.64,33.49)
  Bottom Layer w0.203: v1(31.64,33.49) 31.64,33.31 31.21,32.88 30.6,32.88 C28.2 ; R24.2 U13.3
  vias: v1(21.48,10.01) v1(21.48,9) v1(21.48,7.98) v1(22.5,10.01) v1(22.5,9) v1(22.5,7.98) v1(23.51,10.01) v1(23.51,9) v1(23.51,7.98)
M0_V: length 41.3
  Top Layer w0.203: v1(33.59,37.79) 33.59,36.46 ; R25.1 v1(38.15,18.26)
  Top Layer w0.762: 32.78,18.63 31.8,18.63 ; Q7.1 Q7.2 31.8,18.63 ; 30.87,18.63 31.8,18.63 ; 33.41,18.63 v1(32.78,18.63)
  Inner1 w0.203: 33.08,18.63 37.78,18.63 v1(38.15,18.26) ; v1(33.59,37.79) 33.59,32.62 27.9,26.93 27.9,19.59 28.86,18.63 31.5,18.63
  Bottom Layer w0.203: v1(33.59,37.79) 33.59,38.9 C27.2 ; R26.2 U13.2
  vias: v1(21.48,17.51) v1(21.48,16.49) v1(21.48,15.48) v1(22.5,17.51) v1(22.5,16.49) v1(22.5,15.48) v1(23.51,17.51) v1(23.51,16.49) v1(23.51,15.48) v1(31.5,18.63)
M0_W: length 26.7
  Top Layer w0.203: 35.54,36.43 v1(35.54,33.49) ; R27.1 38.11,25.76
  Top Layer w0.762: Q8.1 v1(32.78,26.13) Q8.2 v1(31.5,26.13) 30.87,26.13
  Inner1 w0.203: v1(37.88,25.78) 37.52,26.13 v1(32.78,26.13) 32.78,28.06 35.54,30.82 v1(35.54,33.49)
  Bottom Layer w0.203: R28.2 U13.1 ; C23.2 36.56,33.49 v1(35.54,33.49)
  vias: v1(21.48,25.01) v1(21.48,23.99) v1(21.48,22.98) v1(22.5,25.01) v1(22.5,23.99) v1(22.5,22.98) v1(23.51,25.01) v1(23.51,23.99) v1(23.51,22.98)
M1_ADC: length 15.7
  Top Layer w0.203: FPC1.21 v1(51.25,34.27)
  Inner2 w0.203: v1(51.25,34.27) 51.25,25.13 53.34,23.04 v1(55.26,23.04)
  Bottom Layer w0.203: U10.6 v1(55.26,23.04)
M1_ADC_A: length 7.8
  Top Layer w0.203: v1(53.71,31.85) 51.75,33.81 FPC1.22
  Bottom Layer w0.203: v1(53.71,31.85) 54.6,31.85 55.05,31.4 55.05,30.47 55.57,29.96 U6.6
M1_ADC_C: length 10.9
  Top Layer w0.203: FPC1.23 v1(52.25,34.27)
  Inner2 w0.203: v1(54.93,26.47) 52.25,29.15 v1(52.25,34.27)
  Bottom Layer w0.203: U9.6 55.85,26.47 v1(54.93,26.47)
M1_BK_OUT: length 20.4
  Top Layer w0.203: FPC1.6 v1(43.75,36.42)
  Inner1 w0.203: v1(43.75,36.42) 43.14,36.42 38.69,40.88 v1(37.65,40.88)
  Bottom Layer w0.203: R78.2 37.65,40.88
M1_HA: length 16.7
  Top Layer w0.203: 61.47,36.46 v1(61.47,33.49) ; D18.1 58.15,22.24 R42.1 v1(59.01,23.91)
  Inner2 w0.203: v1(59.01,23.91) 61.47,26.36 v1(61.47,33.49)
M1_HB: length 25.1
  Top Layer w0.203: R43.1 v1(59.17,16.41) ; 57.88,16.41 57.88,14.74 58.3,14.33 ; 63.42,36.46 v1(63.42,33.49)
  Inner2 w0.203: v1(59.17,16.41) 62.09,19.33 62.09,30.33 63.42,31.66 v1(63.42,33.49)
M1_HC: length 33.5
  Top Layer w0.203: v1(59.17,8.91) R44.1 57.88,8.64 57.88,7.25 58.3,6.83 ; 65.37,36.46 65.37,33.36
  Inner2 w0.203: v1(59.17,8.91) 62.7,12.44 62.7,30.21 64.1,31.6 64.1,32.07 v1(65.37,33.34)
M1_ISENSOR_NA: length 40.3
  Top Layer w0.203: v1(73.23,12.96) v1(68.53,12.96) ; v1(54.38,18.26) 52.99,18.26
  Top Layer w0.762: 73.23,12.96 Q16.2 Q16.3
  Inner1 w0.203: v1(68.53,12.96) 59.68,12.96 v1(54.38,18.26)
  Bottom Layer w0.203: 56.83,27.15 56.83,23.69 ; 56.83,27.15 56.83,30.18 56.41,30.61 U6.5 ; 56.83,27.15 U9.5 ; 56.83,23.69 U10.5 ; 56.83,23.69 56.83,22.18 54.38,19.73 v1(54.38,18.26)
  vias: v1(74.5,12.96)
M1_ISENSOR_PA: length 33.2
  Top Layer w0.203: R57.1 55.48,25.76 56.24,26.52 v1(57.59,26.52) ; v1(68.53,20.46) v1(73.23,20.46)
  Top Layer w0.762: Q15.3 Q15.2 73.23,20.46
  Inner1 w0.203: v1(57.59,26.52) 57.59,22.03 59.16,20.46 v1(68.53,20.46)
  Bottom Layer w0.203: v1(57.59,26.52) 57.59,30.28 56.62,31.26 55.87,31.26
  vias: v1(74.5,20.46)
M1_ISENSOR_PC: length 46.3
  Top Layer w0.203: 53.26,12.43 R60.1
  Top Layer w0.762: Q17.3 Q17.2 Q17.1
  Inner1 w0.203: v1(53.26,12.44) 53.26,12.44 60.23,5.46 v1(73.23,5.46) ; 55.87,25.18 v1(55.87,29.2)
  Inner2 w0.203: v1(53.26,20.08) 55.87,22.7 v1(55.87,25.12)
  Bottom Layer w0.203: v1(55.87,29.2) U9.4 ; v1(53.26,12.44) v1(53.26,20.08)
  vias: v1(74.5,5.46)
M1_LA: length 24.9
  Top Layer w0.203: v1(53.58,24.93) R52.1 53.58,22.24 D21.1 ; 66.67,36.44 v1(66.67,35.08)
  Inner2 w0.203: v1(66.67,35.08) 62.13,35.08 60.9,33.84 60.9,28.79 59.98,27.87 57.13,27.87 55.02,25.76 54.41,25.76 v1(53.58,24.93)
M1_LB: length 35
  Top Layer w0.203: 66.67,30.72 66.67,29.76 66.04,29.13 60.07,29.13 v1(59.9,29.29) ; 53.31,16.41 53.31,14.74 53.73,14.33 ; R53.1 v1(54.6,16.41)
  Inner1 w0.203: v1(59.9,29.29) 58.94,30.26 53.71,30.26 50.3,26.85 50.3,20.7 v1(54.6,16.41)
M1_LC: length 42.8
  Top Layer w0.203: v1(54.6,8.91) R55.1 53.31,8.64 53.31,7.25 53.73,6.83 ; 66.02,30.72 66.02,29.87 65.69,29.54 60.55,29.54 v1(60.23,29.86)
  Inner1 w0.203: v1(60.23,29.86) 59.43,30.66 53.25,30.66 49.73,27.14 49.73,13.78 v1(54.6,8.91)
M1_TIM8_CH1: length 11.3
  Top Layer w0.203: 62.12,30.72 v1(62.12,31.9) ; FPC1.28 v1(54.75,36.27)
  Inner1 w0.203: v1(62.12,31.9) 59.12,31.9 v1(54.75,36.27)
M1_TIM8_CH1N: length 14.3
  Top Layer w0.203: FPC1.29 v1(55.25,36.76) ; 64.07,30.72 v1(64.07,32.85)
  Bottom Layer w0.203: v1(64.07,32.85) 62.55,32.85 62.24,32.54 60.57,32.54 59.17,33.94 58.07,33.94 v1(55.25,36.76)
M1_TIM8_CH2: length 10.9
  Top Layer w0.203: FPC1.26 53.75,34.48 54.42,33.81 59.7,33.81 61.47,32.05 61.47,30.72
M1_TIM8_CH2N: length 12.4
  Top Layer w0.203: 63.42,30.72 63.42,32.36 62.76,33.02 61.27,33.02 60.06,34.22 54.69,34.22 54.25,34.66 FPC1.27
M1_TIM8_CH3: length 10.6
  Top Layer w0.203: 60.82,30.72 56.16,30.72 52.75,34.13 FPC1.24
M1_TIM8_CH3N: length 16.9
  Top Layer w0.203: 62.77,30.72 v1(62.77,31.9) ; FPC1.25 53.25,36.41 54.14,37.3 54.72,37.3
  Inner1 w0.203: v1(54.75,37.3) 54.26,36.81 54.26,35.53 58.67,31.12 62.27,31.12 62.77,31.62 v1(62.77,31.9)
M1_U: length 30.3
  Top Layer w0.203: v1(62.12,33.49) 62.12,36.46 ; R45.1 58.89,25.76
  Top Layer w0.762: Q12.1 v1(66.78,26.13) ; v1(66.78,26.13) 67.1,26.13 ; v1(66.78,26.13) Q12.2 v1(65.5,26.13) Q12.3
  Inner1 w0.203: v1(62.12,33.49) 62.66,33.49 63.74,32.42 63.74,31.27 65.5,29.51 v1(65.5,26.13) 65.13,25.76 v1(58.97,25.76)
  Bottom Layer w0.203: v1(62.12,33.49) 62.12,33.22 61.91,33.02 60.88,33.02 59.02,34.88 C43.2 ; U14.3 R46.2
  vias: v1(73.48,25.01) v1(73.48,23.99) v1(73.48,22.98) v1(74.5,25.01) v1(74.5,23.99) v1(74.5,22.98) v1(75.51,25.01) v1(75.51,23.99) v1(75.51,22.98)
M1_V: length 40.1
  Top Layer w0.203: 64.07,36.46 v1(64.07,37.82) ; v1(58.85,18.26) 57.84,18.26
  Top Layer w0.762: Q13.3 Q13.2 67.1,18.63 ; 67.41,18.63 v1(66.78,18.63)
  Inner1 w0.203: v1(66.78,18.63) 67.99,18.63 69.25,19.9 69.25,28.76 64.07,33.95 v1(64.07,37.82) ; v1(65.5,18.63) 59.22,18.63 v1(58.85,18.26)
  Bottom Layer w0.203: v1(64.07,37.82) 64.07,38.9 C42.2 ; U14.2 R48.2
  vias: v1(73.48,17.51) v1(73.48,16.49) v1(73.48,15.48) v1(74.5,17.51) v1(74.5,16.49) v1(74.5,15.48) v1(75.51,17.51) v1(75.51,16.49) v1(75.51,15.48)
M1_W: length 46.1
  Top Layer w0.203: 66.02,36.46 v1(66.02,33.49) ; v1(58.84,10.76) R49.1
  Top Layer w0.762: Q14.3 v1(65.5,11.13) Q14.2 v1(66.78,11.13) ; 67.1,11.13 v1(66.78,11.13) ; v1(66.78,11.13) Q14.1
  Inner1 w0.203: v1(58.84,10.76) 59.21,11.13 65.2,11.13 ; v1(66.02,33.49) 69.91,29.6 69.91,12.45 68.59,11.13 v1(66.78,11.13)
  Bottom Layer w0.203: C38.2 67.02,33.49 v1(66.02,33.49) ; U14.1 R50.2
  vias: v1(73.48,10.01) v1(73.48,8.99) v1(73.48,7.98) v1(74.5,10.01) v1(74.5,8.99) v1(74.5,7.98) v1(75.51,10.01) v1(75.51,8.99) v1(75.51,7.98)
MOTOR_EN1: length 58.8
  Top Layer w0.203: R16.2 90.95,39.81 v1(90.44,39.81) ; 66.37,28.73 43.81,28.73 42.75,29.79 FPC1.4 ; 66.37,28.73 71.28,28.73 ; 66.37,28.73 66.38,28.73
  Inner2 w0.203: v1(90.44,39.81) 79.35,28.72 v1(71.28,28.72)
MOTOR_EN2: length 20.5
  Top Layer w0.203: R17.2 29.79,28.73 38.91,28.73 41.17,31 41.17,32.66 42.25,33.74 FPC1.3
S0_PWM: length 34.3
  Top Layer w0.203: FPC1.18 v1(49.75,33.79)
  Inner2 w0.203: v1(49.75,33.79) 49.75,14.08 v1(47.1,11.43)
  Bottom Layer w0.203: v1(47.1,11.43) 40.99,11.43 39.74,12.68 U11.3
S1_PWM: length 26.5
  Top Layer w0.203: FPC1.19 v1(50.25,34.27)
  Inner2 w0.203: v1(50.25,34.27) 50.25,16.93 51.85,15.32 v1(56.07,15.32)
  Bottom Layer w0.203: v1(56.07,15.32) U12.1
TEMP0_ADC: length 55.6
  Top Layer w0.203: R68.2 25.26,3.51 26.07,4.32 28.2,4.32 ; FPC1.16 v1(48.75,33.79) ; 32.07,4.32 28.2,4.32 ; 32.07,4.32 40.57,4.32 41.57,5.32 41.57,10.78 42.89,12.1 v1(45.63,12.1) ; 32.07,4.32 R64.1 ; 28.2,4.32 C50.2
  Inner2 w0.203: v1(45.63,12.1) 48.75,15.22 v1(48.75,33.79)
TEMP1_ADC: length 56.1
  Top Layer w0.203: 64.93,4.32 68.8,4.32 ; 64.93,4.32 52.14,4.32 50.49,5.97 50.49,15.69 v1(49.25,16.92) ; 64.93,4.32 R65.1 ; 68.8,4.32 70.93,4.32 71.74,3.51 R69.2 ; 68.8,4.32 C51.2 ; FPC1.17 v1(49.25,34.27)
  Inner2 w0.203: v1(49.25,34.27) v1(49.25,16.92)
VOLTAGE_ADC: length 25.4
  Top Layer w0.203: FPC1.15 v1(48.25,34.27) ; R13.1 v1(27.38,36.15)
  Inner1 w0.203: v1(48.25,34.27) 47.2,35.33 39.87,35.33 36.64,38.55 29.78,38.55 v1(27.38,36.15)
VREF: length 43.4
  Top Layer w0.203: 48.5,13.13 47.95,13.68 C52.2 47.95,17.84 R66.2 50.15,18.39 v1(50.89,19.13)
  Bottom Layer w0.203: U6.1 54.39,29.14 54.39,26.5 ; 43.43,27.8 42.49,27.8 ; 42.49,27.8 42.49,30.98 42.77,31.26 43.43,31.26 ; 42.49,27.8 42.49,24.34 ; U7.1 42.49,24.34 ; 42.49,24.34 42.49,22.37 45.74,19.13 v1(50.89,19.13) 53.57,21.81 U10.1 53.99,23.04 54.39,23.44 54.39,26.5 ; U9.1 54.39,26.5
$1N915: length 10.8
  Top Layer w0.508: F1.2 73.44,43.97 D1.2
$1N1850: length 4
  Top Layer w0.203: U2.4 82.42,33.47 R11.1
$1N2022: length 17
  Top Layer w0.203: U2.3 v1(75.95,32.31) R12.2 ; R4.1 66,38.04 v1(67.44,38.04)
  Bottom Layer w0.203: v1(67.44,38.04) 70.22,38.04 v1(75.95,32.31)
$1N3202: length 15.4
  Top Layer w0.203: Q5.1 15.29,32.43 15.29,31.84 16.74,30.39 22.85,30.39 24.48,32.03 R19.1 R17.1
$1N3206: length 13.4
  Top Layer w0.203: 21.91,37.59 23.32,36.18 23.32,34.31 22.97,33.96 R1.1 22.58,33.95 R8.2 22.57,32.03 Q3.1 19.32,33.23 19.32,34.45 Q2.1
$1N3210: length 6.8
  Top Layer w0.203: Q5.3 17.61,31.16 R8.1
$1N3644: length 7.3
  Top Layer w0.203: R13.2 26.31,37.76 25.45,36.9 R5.1 R14.1 27.33,34.85 C15.2
$1N7751: length 5.4
  Top Layer w0.203: 30.34,36.46 v1(30.34,37.82)
  Bottom Layer w0.203: C28.1 29.03,36.79 30.34,36.79 ; 30.34,36.79 D8.1 ; 30.34,36.79 v1(30.34,37.82)
$1N7797: length 4.4
  Top Layer w0.203: 32.29,36.46 v1(32.29,37.82)
  Bottom Layer w0.203: D7.1 33.26,36.85 v1(32.29,37.82) 32.29,39 C27.1
$1N7802: length 5.8
  Top Layer w0.203: 34.24,36.46 v1(34.24,37.82)
  Bottom Layer w0.203: C23.1 37.51,36.79 D6.1 34.24,37.75 v1(34.24,37.82)
$1N8638: length 18
  Top Layer w0.203: v1(41.05,10.76) R23.2 40.04,9.23 R20.2 40.36,7.25 D9.2 ; Q6.4 v1(29.6,10.12)
  Inner1 w0.203: v1(29.6,10.12) 40.41,10.12 v1(41.05,10.76)
$1N9075: length 2.3
  Bottom Layer w0.203: R24.1 C24.1
$1N9358: length 30.6
  Top Layer w0.203: Q9.4 v1(24.4,4.41) ; D12.2 44.93,7.25 R30.2 44.61,9.23 R35.2 v1(45.63,10.76)
  Inner2 w0.203: v1(24.4,4.41) 40,4.41 45.63,10.04 v1(45.63,10.76)
$1N10733: length 19.8
  Top Layer w0.203: D10.2 40.77,15.99 R21.2 40.04,16.73 R25.2 v1(41.94,18.26) ; Q7.4 29.6,17.62
  Inner1 w0.203: v1(41.94,18.26) 41.29,17.61 v1(29.6,17.61)
$1N10760: length 2.3
  Bottom Layer w0.203: C25.1 R26.1
$1N10771: length 29.7
  Top Layer w0.203: D13.2 44.93,14.74 R31.2 44.61,16.73 R36.2 v1(45.88,18.26) ; Q10.4 25.08,12.29 v1(28.47,12.29)
  Inner1 w0.203: v1(45.88,18.26) 39.91,12.29 v1(28.47,12.29)
$1N11350: length 15.7
  Top Layer w0.203: 40.04,25.1 40.04,24.23 R22.2 40.77,23.49 D11.2 ; 40.04,25.1 R27.2 ; 40.04,25.1 v1(38.84,25.1) ; Q8.4 v1(29.6,25.12)
  Inner1 w0.203: v1(29.6,25.12) 38.83,25.12 v1(38.84,25.1)
$1N11377: length 2.3
  Bottom Layer w0.203: R28.1 C26.1
$1N11388: length 30.8
  Top Layer w0.203: 28.46,19.79 25.08,19.79 Q11.4 ; v1(45.97,25.76) R38.2 44.61,24.23 R33.2 44.93,22.24 D14.2
  Inner1 w0.203: v1(45.97,25.76) 45.97,24.22 41.53,19.79 v1(28.47,19.79)
$1N20159: length 33.3
  Top Layer w0.203: 75.5,12.06 Q16.4 75.5,12.06 ; 75.5,12.06 v1(68.53,12.06) ; D22.2 52.07,14.74 R53.2 52.39,16.73 R58.2
  Inner1 w0.203: v1(58.84,12.06) v1(68.53,12.06)
  Inner2 w0.203: v1(58.84,12.06) 58.84,14.13 55.97,17 52.83,17 v1(52.39,17.44)
$1N20164: length 31.7
  Top Layer w0.203: v1(52.39,24.87) R57.2 v1(52.39,24.87) ; v1(52.39,24.87) 52.39,24.23 R52.2 52.07,22.24 D21.2 ; Q15.4 75.5,19.56 v1(70.46,19.56)
  Inner1 w0.203: v1(52.39,24.87) 57.7,19.56 v1(65.49,19.56)
  Inner2 w0.203: v1(65.49,19.56) v1(70.46,19.56)
$1N20183: length 2.3
  Bottom Layer w0.203: R48.1 C40.1
$1N20187: length 12.2
  Top Layer w0.203: R47.2 56.64,17.94 v1(56.64,17.61) R43.2 56.64,14.74 D19.2 ; Q13.4 63.6,17.61
  Inner1 w0.203: 56.63,17.61 v1(63.6,17.61)
$1N20191: length 2.3
  Bottom Layer w0.203: R46.1 C39.1
$1N20194: length 11.9
  Top Layer w0.203: 56.97,25.12 56.97,24.23 R42.2 56.64,22.24 D18.2 ; 56.97,25.12 R45.2 ; 56.97,25.12 v1(58.61,25.12) ; Q12.4 63.6,25.12
  Inner1 w0.203: v1(58.61,25.12) 63.6,25.12
  vias: v1(63.6,25.12)
$1N20215: length 33.8
  Top Layer w0.203: 76.4,4.56 Q17.4 76.41,5.46 ; D23.2 52.07,7.25 R55.2 52.39,9.23 R60.2 ; 52.39,10.76 v1(51.37,10.76)
  Inner2 w0.203: v1(51.37,10.76) 57.57,4.56 v1(76.4,4.56)
$1N20218: length 2.3
  Bottom Layer w0.203: R50.1 C41.1
$1N20219: length 13.9
  Top Layer w0.203: D20.2 56.64,7.25 R44.2 56.97,9.23 R49.2 v1(55.94,10.76) ; 63.29,11.14 v1(63.29,10.12)
  Inner1 w0.203: v1(55.94,10.76) 56.59,10.12 v1(63.29,10.12)
$1N20229: length 5.4
  Top Layer w0.203: 60.82,36.46 v1(60.82,37.82)
  Bottom Layer w0.203: v1(60.82,37.82) 60.82,36.79 ; 60.82,36.79 59.49,36.79 C43.1 ; 60.82,36.79 D17.1
$1N20256: length 4.4
  Top Layer w0.203: 62.77,36.46 v1(62.77,37.82)
  Bottom Layer w0.203: D16.1 63.74,36.85 v1(62.77,37.82) 63.04,38.1 C42.1
$1N20257: length 5.8
  Top Layer w0.203: 64.72,36.46 v1(64.72,37.82)
  Bottom Layer w0.203: C38.1 66.14,36.32 D15.1 65.67,36.87 v1(64.72,37.82)
$1N36343: length 3.5
  Top Layer w0.508: LED1.1 89.07,47.31 R70.1
$1N36459: length 25.5
  Top Layer w0.203: 43.27,41.56 v1(43.27,40.77)
  Inner2 w0.203: v1(43.27,40.77) 39.58,40.77 38.34,39.53 38.34,33.69 43.39,28.63 47.18,28.63 v1(47.84,29.29)
  Bottom Layer w0.203: v1(47.84,29.29) 48.5,28.63 48.5,28.01
$1N64887: length 5.1
  Top Layer w0.203: Q4.1 92.35,36.8 R18.1 R16.1
$1N64889: length 2.7
  Top Layer w0.203: Q4.3 91.4,30.89 91.5,30.79 91.5,30.74 R7.1
$1N69829: length 10.9
  Top Layer w0.203: C14.1 87.65,39.56 R6.1 87.65,35.65 Q1.1 89.32,33.98 89.32,32.06 R7.2
$1N79068: length 4
  Top Layer w0.762: D3.2 87.22,29.3 Q1.3
$1N124629: length 18.5
  Top Layer w1.27: Q3.3 15.77,35.42 Q2.3 9.64,36.64 D5.2
$1N126042: length 3.9
  Bottom Layer w0.381: D24.2 30.99,43.75 Q19.3
$1N126056: length 5.5
  Bottom Layer w0.203: Q21.1 R76.1 R77.1
$1N126057: length 5.3
  Bottom Layer w0.203: R74.1 35.01,48.55 Q21.3
$1N126058: length 7.3
  Bottom Layer w0.203: C60.1 R72.1 ; C60.1 Q19.1 ; C60.1 R74.2
$1N126455: length 3.1
  Bottom Layer w0.381: Q20.3 26.52,44.9 D25.2
$1N126462: length 8.5
  Inner1 w0.203: v1(26.35,36.43) 25.18,37.6 v1(23.44,37.6)
  Bottom Layer w0.203: Q22.1 v1(23.44,37.6) ; v1(26.35,36.43) R79.1 26.4,37.2 27.01,37.81 27.01,39.35 26.35,40.01
$1N126467: length 18.8
  Inner1 w0.203: v1(22.46,39.78) 24.42,41.74 v1(24.42,44.46)
  Bottom Layer w0.203: 23.27,44.45 23.27,48.02 22.39,48.9 R73.1 ; 23.27,44.45 24.41,44.45 v1(24.42,44.46) 25.11,43.77 27.09,43.77 28.26,42.6 Q20.1 ; 23.27,44.45 C61.1 ; R75.2 v1(22.46,39.78)
$1N126474: length 2.2
  Bottom Layer w0.203: 23.33,40.49 23.33,39.48 Q22.3
$1N126564: length 29.2
  Bottom Layer w0.381: D25.1 D24.1
  Bottom Layer w0.508: U15.1 49.15,49.79 43.47,49.79 40.52,52.74 30.93,52.74 D24.1
$1N167795: length 12.9
  Top Layer w0.203: R2.1 R9.2 53.36,42.85 55.51,40.7 61,40.7 U1.5
$1N168255: length 6.2
  Top Layer w0.203: C3.1 55.4,50.01 54.78,49.39 54.78,47.68 56.7,45.76 U1.1
$1N168264: length 14.2
  Top Layer w0.508: 62.26,47.27 63.83,48.84 D4.1 L1.1 ; 62.26,47.27 57.49,47.27 C3.2 ; 62.26,47.27 U1.8
$1N168458: length 12.9
  Top Layer w0.203: v1(63.82,42.35) R10.2 R3.1 ; U1.4 v1(55.61,41.95)
  Inner1 w0.203: v1(55.61,41.95) 63.45,41.95 63.82,42.32 v1(63.82,42.35)
$1N213205: length 9
  Top Layer w0.508: U2.1 75.2,36.12 L2.2 74.34,39.63 D2.2

## Copper pours and planes (outline as drawn; the poured copper is in the pictures)
DGND on Top Layer: 42.15,34.96 54.85,34.96 54.85,15.4 42.15,15.4
DGND on Top Layer: 38.85,39.99 58.15,39.99 58.15,34.65 38.85,34.65
DGND on Bottom Layer: 42.15,34.96 54.85,34.96 54.85,15.4 42.15,15.4
DGND on Bottom Layer: 38.85,39.99 58.15,39.99 58.15,34.65 38.85,34.65
DGND on Inner1: 38.85,39.99 58.15,39.99 58.15,34.65 38.85,34.65
DGND on Inner1: 42.15,34.96 54.85,34.96 54.85,15.4 42.15,15.4
DGND on Inner2: 42.15,34.96 54.85,34.96 54.85,15.4 42.15,15.4
DGND on Inner2: 38.85,39.99 58.15,39.99 58.15,34.65 38.85,34.65
PGND on Top Layer: -3.22,59.65 99.25,59.65 99.25,-2.08 -3.22,-2.08
PGND on Bottom Layer: -3.22,59.65 99.25,59.65 99.25,-2.08 -3.22,-2.08
PGND on Inner1: -3.22,59.65 99.25,59.65 99.25,-2.08 -3.22,-2.08
PGND on Inner2: -3.22,59.65 99.25,59.65 99.25,-2.08 -3.22,-2.08
VIN on Bottom Layer: 65.5,16.88 67.28,16.88 67.28,13.33 65.5,13.33
VIN on Bottom Layer: 29.72,9.38 31.5,9.38 31.5,5.83 29.72,5.83
VIN on Bottom Layer: 29.72,16.88 31.5,16.88 31.5,13.33 29.72,13.33
VIN on Bottom Layer: 29.72,24.38 31.5,24.38 31.5,20.83 29.72,20.83
VIN on Bottom Layer: 65.5,24.38 67.28,24.38 67.28,20.83 65.5,20.83
VIN on Bottom Layer: 65.5,9.38 67.28,9.38 67.28,5.83 65.5,5.83
M0_ISENSOR_NA on Bottom Layer: 18.79,13.51 23.43,13.51 23.43,12.42 18.79,12.42
M0_ISENSOR_NA on Bottom Layer: 18.79,14.51 20.07,14.51 20.07,12.42 18.79,12.42
M0_ISENSOR_NA on Bottom Layer: 18.84,24.98 20.03,24.98 20.03,6.62 18.84,6.62
M0_ISENSOR_PA on Bottom Layer: 20.3,6.01 26.2,6.01 26.2,4.92 20.3,4.92
M0_ISENSOR_PA on Bottom Layer: 24.93,6.63 26.2,6.63 26.2,4.92 24.93,4.92
M0_ISENSOR_PC on Bottom Layer: 24.93,21.63 26.2,21.63 26.2,19.92 24.93,19.92
M0_ISENSOR_PC on Bottom Layer: 20.3,21.01 26.2,21.01 26.2,19.92 20.3,19.92
M0_U on Top Layer: 11.57,13.73 15.2,13.73 15.2,10.87 11.57,10.87
M0_U on Top Layer: 11.57,11.19 20.2,11.19 20.2,6.95 11.57,6.95
M0_U on Top Layer: 13.24,13.73 24.8,13.73 24.8,6.95 13.24,6.95
M0_U on Bottom Layer: 20.72,11.68 33.7,11.68 33.7,10.59 20.72,10.59
M0_U on Bottom Layer: 20.72,10.77 24.28,10.77 24.28,7.22 20.72,7.22
M0_V on Top Layer: 13.24,18.54 24.8,18.54 24.8,14.37 13.24,14.37
M0_V on Top Layer: 11.57,17.23 15.2,17.23 15.2,14.37 11.57,14.37
M0_V on Bottom Layer: 20.72,19.18 33.7,19.18 33.7,18.09 20.72,18.09
M0_V on Bottom Layer: 20.72,18.27 24.28,18.27 24.28,14.72 20.72,14.72
M0_W on Top Layer: 11.57,20.73 15.2,20.73 15.2,17.87 11.57,17.87
M0_W on Top Layer: 11.57,20.73 15.2,20.73 15.2,19.31 11.57,19.31
M0_W on Top Layer: 15.2,26.04 20.2,26.04 20.2,17.87 15.2,17.87
M0_W on Top Layer: 11.57,19.31 15.2,19.31 15.2,17.87 11.57,17.87
M0_W on Top Layer: 11.57,26.04 17.2,26.04 17.2,20.41 11.57,20.41
M0_W on Top Layer: 11.57,26.04 20.52,26.04 20.52,20.41 11.57,20.41
M0_W on Bottom Layer: 20.72,26.68 33.7,26.68 33.7,25.59 20.72,25.59
M0_W on Bottom Layer: 20.72,25.77 24.28,25.77 24.28,22.21 20.72,22.21
M1_ISENSOR_NA on Bottom Layer: 76.97,24.98 78.16,24.98 78.16,6.62 76.97,6.62
M1_ISENSOR_NA on Bottom Layer: 72.3,13.51 78.2,13.51 78.2,12.42 72.3,12.42
M1_ISENSOR_NA on Bottom Layer: 76.93,14.13 78.2,14.13 78.2,12.42 76.93,12.42
M1_ISENSOR_PA on Bottom Layer: 70.79,21.01 75.43,21.01 75.43,19.92 70.79,19.92
M1_ISENSOR_PA on Bottom Layer: 70.79,22.01 72.07,22.01 72.07,19.92 70.79,19.92
M1_ISENSOR_PC on Bottom Layer: 70.79,7.01 72.07,7.01 72.07,4.92 70.79,4.92
M1_ISENSOR_PC on Bottom Layer: 70.79,6.01 75.43,6.01 75.43,4.92 70.79,4.92
M1_U on Top Layer: 76.8,26.04 81.8,26.04 81.8,17.87 76.8,17.87
M1_U on Top Layer: 76.48,26.04 85.43,26.04 85.43,20.41 76.48,20.41
M1_U on Top Layer: 81.8,20.73 85.43,20.73 85.43,17.87 81.8,17.87
M1_U on Top Layer: 79.8,26.04 85.43,26.04 85.43,20.41 79.8,20.41
M1_U on Bottom Layer: 64.57,26.68 76.27,26.68 76.27,25.59 64.57,25.59
M1_U on Bottom Layer: 72.72,25.77 76.28,25.77 76.28,22.22 72.72,22.22
M1_V on Top Layer: 72.2,18.54 83.76,18.54 83.76,14.37 72.2,14.37
M1_V on Top Layer: 81.8,17.23 85.43,17.23 85.43,14.37 81.8,14.37
M1_V on Bottom Layer: 72.72,18.27 76.28,18.27 76.28,14.72 72.72,14.72
M1_V on Bottom Layer: 64.57,19.18 76.27,19.18 76.27,18.09 64.57,18.09
M1_W on Top Layer: 76.8,11.19 85.43,11.19 85.43,6.94 76.8,6.94
M1_W on Top Layer: 81.8,13.73 85.43,13.73 85.43,10.87 81.8,10.87
M1_W on Top Layer: 72.2,13.73 83.76,13.73 83.76,6.94 72.2,6.94
M1_W on Bottom Layer: 72.72,10.77 76.28,10.77 76.28,7.22 72.72,7.22
M1_W on Bottom Layer: 64.57,11.68 76.27,11.68 76.27,10.59 64.57,10.59

Small or netless copper shapes (teardrops, artwork), in the pictures only: 440 on Top Layer, 240 on Bottom Layer, 84 on Inner1, 57 on Inner2

## Text on the board
Bottom Silkscreen Layer: SCREWS | 30 | 5V | GND | PWM | Voltage/Current Measurement | [Dual Brushless Motors] | [Dual Servo Motors] | Current Loop | Brake | NTC | M4x4 | ~ | MOTORS DRIVER | ▲ | S1 | PW-M | 24 | XT | MR | 12 | BRAKE | S0 | + | MOTOR0 | FOC | MOTOR1 | -
Top Silkscreen Layer: JLCJLCJLCJLC | 5V_LED | Motor_Ctrl | SVPWM
